# EAGLE design shield_scaffold (EAGLE 5.11)
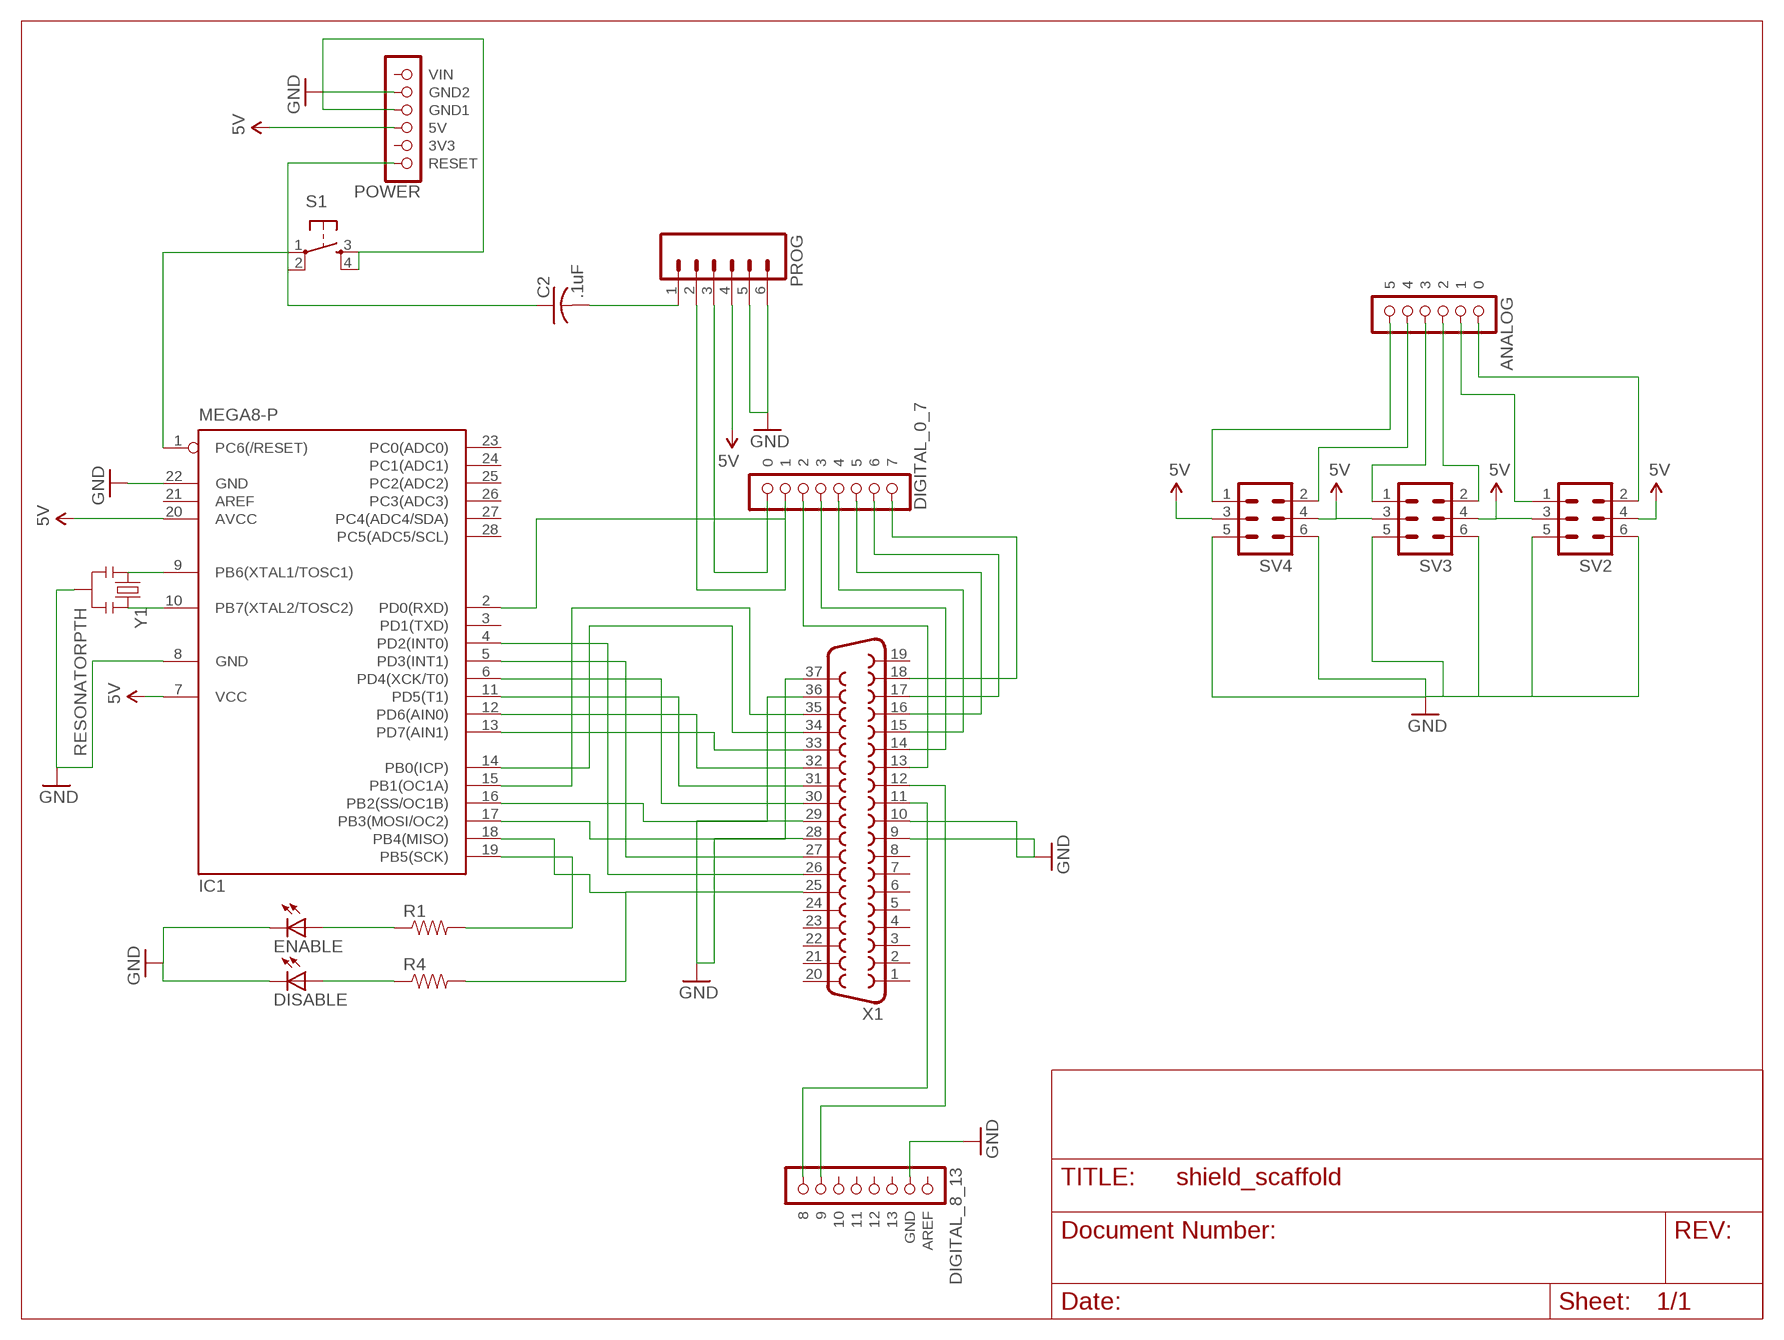
[diagram p0: schematic, sheet 1]

## Parts
C2  .1uF  C-US025-024X044  [C025-024X044]
DISABLE  LED5MM  [LED5MM]
ENABLE  LED5MM  [LED5MM]
IC1  MEGA8-P  [DIL28-3]
PROG  M06SIP_LOCK  [1X06-SIP_LOCK]
R1  RESISTORAXIAL-0.3  [AXIAL-0.3]
R4  RESISTORAXIAL-0.3  [AXIAL-0.3]
S1  TAC_SWITCHPTH  [TACTILE-PTH]
SV2  MA03-2  [MA03-2]
SV3  MA03-2  [MA03-2]
SV4  MA03-2  [MA03-2]
U$1  POWER  [1X06]
U$2  ANALOG  [1X06]
U$3  DIGITAL_0_7  [1X08]
U$4  DIGITAL_8_13  [1X08]
X1  F37VP  [F37VP]
Y1  RESONATORPTH  [RESONATOR-PTH]

## Nets
5V: IC1.7(VCC) IC1.20(AVCC) PROG.4 SV2.3 SV2.4 SV3.3 SV3.4 SV4.3 SV4.4 U$1.3(5V)
GND: DISABLE.K(C) ENABLE.K(C) IC1.8(GND) IC1.22(GND) PROG.5 PROG.6 S1.3 S1.4 SV2.5 SV2.6 SV3.5 SV3.6 SV4.5 SV4.6 U$1.4(GND1) U$1.5(GND2) U$4.2(GND) X1.9 X1.10 X1.28 X1.29 Y1.2
N$1: IC1.2(PD0(RXD)) PROG.2 U$3.7
N$2: IC1.9(PB6(XTAL1/TOSC1)) Y1.1
N$3: IC1.10(PB7(XTAL2/TOSC2)) Y1.3
N$4: SV2.2 U$2.1
N$5: SV2.1 U$2.2
N$6: SV3.2 U$2.3
N$7: SV3.1 U$2.4
N$8: SV4.2 U$2.5
N$9: SV4.1 U$2.6
N$10: U$4.7 X1.12
N$11: U$3.6 X1.13
N$12: U$3.5 X1.14
N$13: U$4.8 X1.11
N$14: U$3.4 X1.15
N$15: U$3.3 X1.16
N$16: U$3.2 X1.17
N$17: U$3.1 X1.18
N$18: IC1.19(PB5(SCK)) R1.P$2
N$19: IC1.4(PD2(INT0)) X1.26
N$20: IC1.5(PD3(INT1)) X1.27
N$21: IC1.6(PD4(XCK/T0)) X1.30
N$22: IC1.11(PD5(T1)) X1.31
N$23: IC1.18(PB4(MISO)) R4.P$2 X1.25
N$24: PROG.3 U$3.8
N$25: ENABLE.A R1.P$1
N$26: DISABLE.A R4.P$1
N$27: IC1.12(PD6(AIN0)) X1.32
N$28: IC1.13(PD7(AIN1)) X1.33
N$29: IC1.14(PB0(ICP)) X1.34
N$30: IC1.15(PB1(OC1A)) X1.35
N$31: IC1.16(PB2(SS/OC1B)) X1.36
N$32: IC1.17(PB3(MOSI/OC2)) X1.37
N$33: C2.2 PROG.1
N$34: C2.1 IC1.1(PC6(/RESET)) S1.1 S1.2 U$1.1(RESET)
Unconnected: IC1.3(PD1(TXD)) IC1.21(AREF) IC1.23(PC0(ADC0)) IC1.24(PC1(ADC1)) IC1.25(PC2(ADC2)) IC1.26(PC3(ADC3)) IC1.27(PC4(ADC4/SDA)) IC1.28(PC5(ADC5/SCL)) U$1.2(3V3) U$1.6(VIN) U$4.1(AREF) U$4.3 U$4.4 U$4.5 U$4.6 X1.1 X1.2 X1.3 X1.4 X1.5 X1.6 X1.7 X1.8 X1.19 X1.20 X1.21 X1.22 X1.23 X1.24

## Library data of the parts
C2 = rcl:C-US: CAPACITOR, American symbol
DISABLE ENABLE = SparkFun:LED: LEDs Standard schematic elements and footprints for 5mm, 3mm, 1206, and 0603 sized LEDs. 5mm - Spark Fun Electronics SKU : COM-00529 (and others)
IC1 = atmel:MEGA8-P: MICROCONTROLLER 8 Kbytes FLASH, 1 kbytes SRAM, 512 bytes EEPROM, USART, 4-channel 10 bit ADC, 2-channel 8 bit ADC Pin compatible with Atmega48, ATMega88, ATMega168 Source: avr.lbr; OC_FARNELL: unknown; OC_NEWARK: unknown
PROG = SparkFun:M06: Header 6 Standard 6-pin 0.1" header. Use with straight break away headers (SKU : PRT-00116), right angle break away headers (PRT-00553), swiss pins (PRT-00743), machine pins (PRT-00117), and female headers (PRT-00115). Molex polarized connector foot print use with SKU : PRT-08094 with associated crimp pins and housings. NOTES ON THE VARIANTS LOCK and LOCK_LONGPADS... This footprint was designed to help hold the alignment of a through-hole component (i.e. 6-pin header) while soldering it into place. You may notice that each hole has been shifted either up or down by 0.005 of an inch from it's more standard position (which is a perfectly straight line). This slight alteration caused the pins (the squares in the middle) to touch the edges of the holes. Because they are alternating, it causes a "brace" to hold the component in place. 0.005 has proven to be the perfect amount of "off-center" position when using our standard breakaway headers. Although looks a little odd when you look at the bare footprint, once you have a header in there, the alteration is very hard to notice. Also, if you push a header all the way into place, it is covered up entirely on the bottom side. This idea of altering the position of holes to aid alignment will be further integrated into the Sparkfun Library for other footprints. It can help hold any component with 3 or more connection pins.
R1 R4 = SparkFun:RESISTOR: Resistor Basic schematic elements and footprints for 0603, 1206, and PTH resistors.
S1 = SparkFun:TAC_SWITCH: Momentary Switch Button commonly used for reset or general input. Spark Fun Electronics SKU : COM-00097
SV2-SV4 = con-lstb:MA03-2: PIN HEADER; OC_FARNELL: unknown; OC_NEWARK: unknown
U$1 = arduino:POWER
U$2 = arduino:ANALOG
U$3 = arduino:DIGITAL_0_7
U$4 = arduino:DIGITAL_8_13
X1 = con-subd:F37: SUB-D; OC_FARNELL: unknown; OC_NEWARK: unknown
Y1 = SparkFun:RESONATOR: Resonator Small SMD resonator. This is the itty bitty 10/20MHz resonators with built in caps. CSTCE10M0G55 and CSTCE20M0V53. Footprint has been reviewed closely but hasn't been tested yet.

## Board
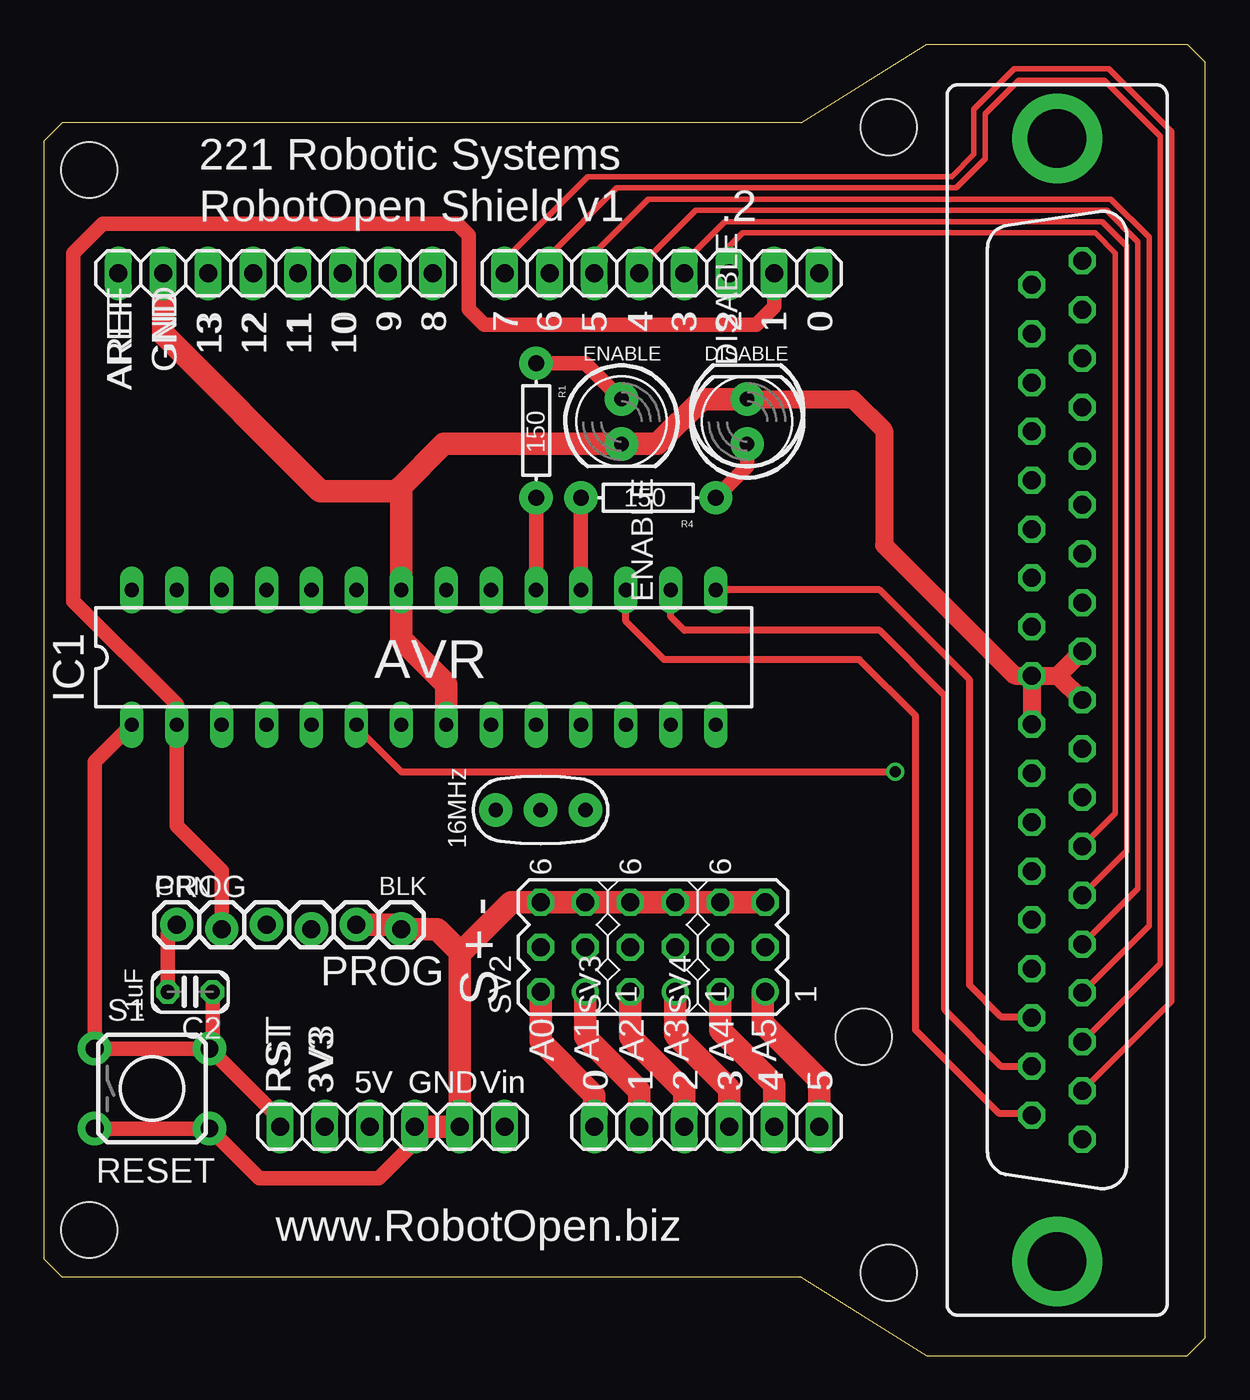
[diagram p1: board, top side]
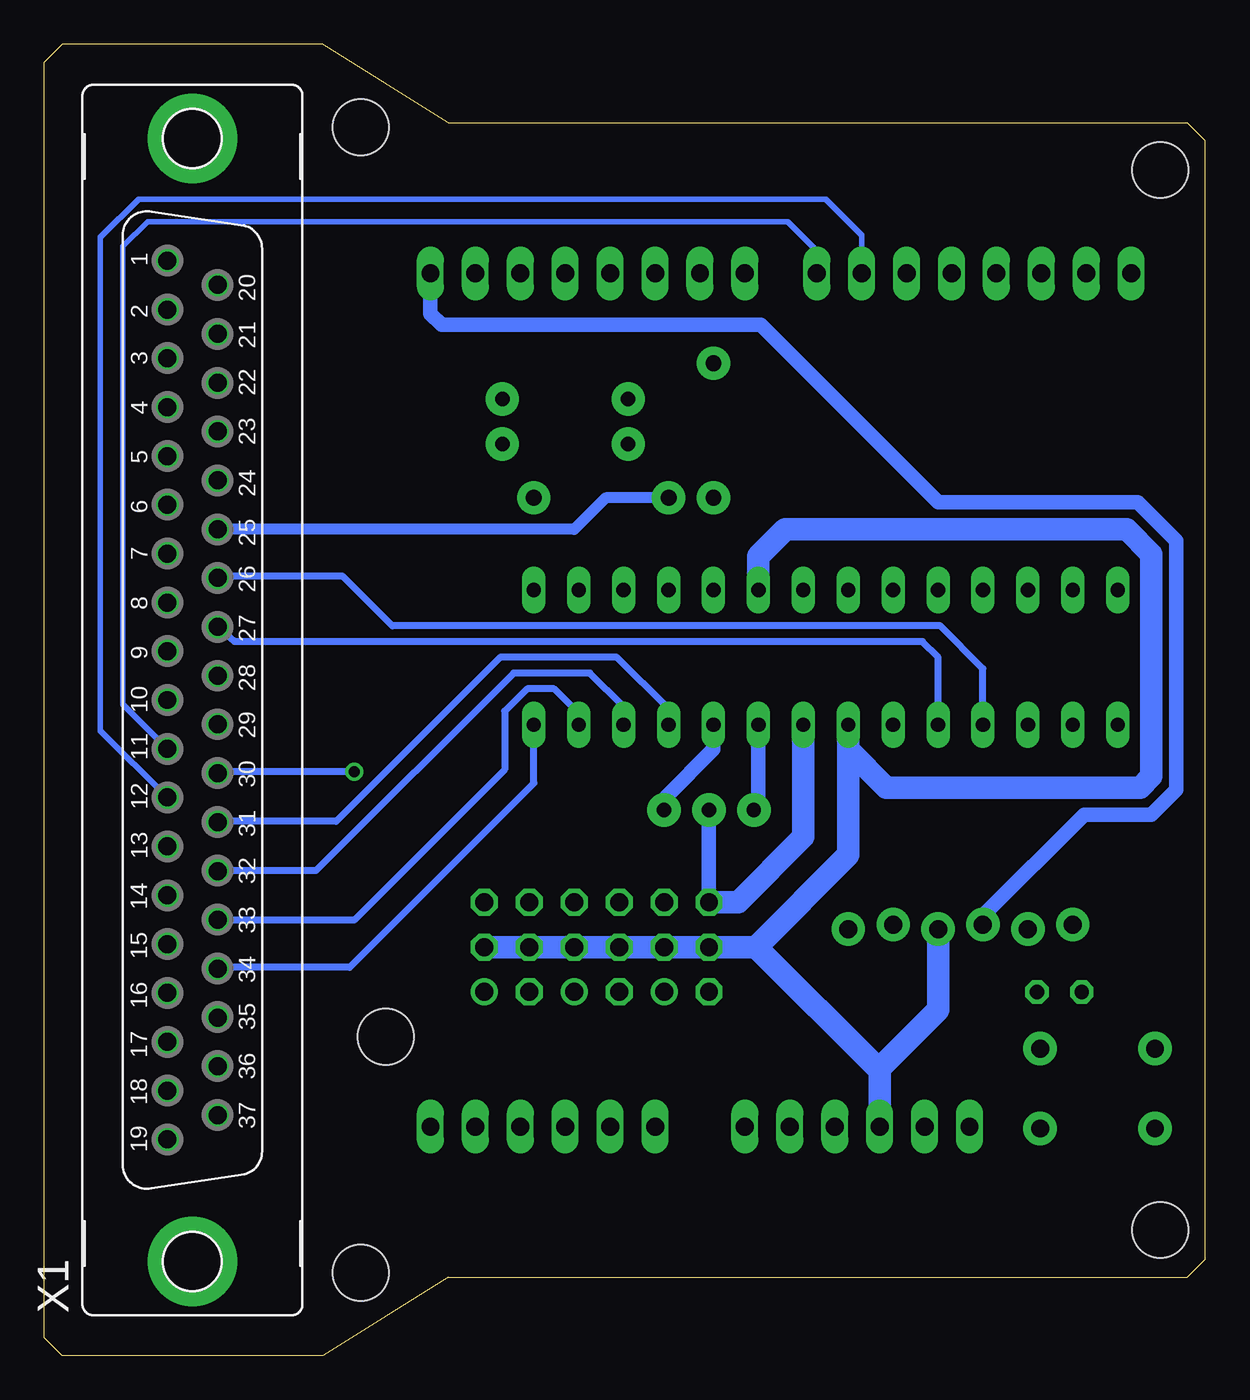
[diagram p2: board, bottom side, seen from below]

Size 65.66 x 74.17 mm. Coordinates in mm from the lower left corner, seen from the top.
Outline: 64.64,0 65.66,1.02 65.66,73.15 64.64,74.17 49.91,74.17 42.8,69.72 1.02,69.72 0,68.71 0,5.46 1.02,4.45 42.8,4.45 49.91,0 64.64,0
Copper layers (1*16): Top 0.035mm / dielectric 1.5mm / Bottom 0.035mm
Design rules "default": minimum track width 10mil, minimum drill 24mil, track to track 8mil, track to pad 8mil, pad to pad 8mil, via to via 8mil, smd to smd 8mil, copper to edge 40mil, drill to drill 8mil, minimum pad ring 10mil, minimum via ring 8mil, stop-mask expansion 4mil, vias tented up to drill 0mil, thermal gap 10mil
Holes 3.17 mm at 46.36,18.03 2.54,67.06 47.75,69.47 2.54,7.11 47.75,4.7

### Footprints (pad centres in the part's own frame; a part is rotated, then mirrored left to right if it is on the bottom)
C025-024X044 = drill 0.813 octagon: 1 -1.27,0; 2 1.27,0
LED5MM = drill 0.813 pad 1.88 round: A -1.27,0; K 1.27,0
DIL28-3 = drill 0.813 long: 1 -16.51,-3.81; 2 -13.97,-3.81; 3 -11.43,-3.81; 4 -8.89,-3.81; 5 -6.35,-3.81; 6 -3.81,-3.81; 7 -1.27,-3.81; 8 1.27,-3.81; 9 3.81,-3.81; 10 6.35,-3.81; 11 8.89,-3.81; 12 11.43,-3.81; 13 13.97,-3.81; 14 16.51,-3.81; 15 16.51,3.81; 16 13.97,3.81; 17 11.43,3.81; 18 8.89,3.81; 19 6.35,3.81; 20 3.81,3.81; 21 1.27,3.81; 22 -1.27,3.81; 23 -3.81,3.81; 24 -6.35,3.81; 25 -8.89,3.81; 26 -11.43,3.81; 27 -13.97,3.81; 28 -16.51,3.81
1X06-SIP_LOCK = drill 1.016 pad 1.88 round: 1 0,0; 2 2.54,-0.254; 3 5.08,0; 4 7.62,-0.254; 5 10.16,0; 6 12.7,-0.254
AXIAL-0.3 = drill 0.9 pad 1.88 round: P$1 -3.81,0; P$2 3.81,0
TACTILE-PTH = drill 1.016 pad 1.88 round: 1 -3.251,2.261; 2 3.251,2.261; 3 -3.251,-2.261; 4 3.251,-2.261
MA03-2 = drill 1.016 round: 1 -2.54,-1.27 | drill 1.016 octagon: 2 -2.54,1.27; 3 0,-1.27; 4 0,1.27; 5 2.54,-1.27; 6 2.54,1.27
1X06 = drill 1.016 long: 1 -6.35,0; 2 -3.81,0; 3 -1.27,0; 4 1.27,0; 5 3.81,0; 6 6.35,0
1X08 = drill 1.016 long: 1 -8.89,0; 2 -6.35,0; 3 -3.81,0; 4 -1.27,0; 5 1.27,0; 6 3.81,0; 7 6.35,0; 8 8.89,0
F37VP = drill 1.016 octagon: 1 24.841,1.422; 2 22.073,1.422; 3 19.329,1.422; 4 16.561,1.422; 5 13.792,1.422; 6 11.049,1.422; 7 8.28,1.422; 8 5.512,1.422; 9 2.769,1.422; 10 0,1.422; 11 -2.769,1.422; 12 -5.512,1.422; 13 -8.28,1.422; 14 -11.049,1.422; 15 -13.818,1.422; 16 -16.561,1.422; 17 -19.329,1.422; 18 -22.098,1.422; 19 -24.841,1.422; 20 23.47,-1.422; 21 20.701,-1.422; 22 17.932,-1.422; 23 15.189,-1.422; 24 12.421,-1.422; 25 9.652,-1.422; 26 6.909,-1.422; 27 4.14,-1.422; 28 1.372,-1.422; 29 -1.372,-1.422; 30 -4.14,-1.422; 31 -6.909,-1.422; 32 -9.677,-1.422; 33 -12.421,-1.422; 34 -15.189,-1.422; 35 -17.958,-1.422; 36 -20.701,-1.422; 37 -23.47,-1.422 | drill 3.302 pad 5.08 round: G1 -31.75,0; G2 31.75,0
RESONATOR-PTH = drill 0.8 pad 1.88 round: 1 -2.54,0; 2 0,0; 3 2.54,0

### Placement (x,y rotation side)
C2  8.26,20.57 180 top
DISABLE  39.75,52.83 90 top
ENABLE  32.64,52.83 270 top
IC1  21.46,39.5 0 top
PROG  7.49,24.38 0 top
R1  27.81,52.32 270 top
R4  34.16,48.51 180 top
S1  6.1,15.11 0 top
SV2  29.34,23.11 90 top
SV3  34.42,23.11 90 top
SV4  39.5,23.11 90 top
U$1  19.69,12.95 0 top
U$2  37.47,12.95 0 top
U$3  34.93,61.21 0 top
U$4  13.08,61.21 0 top
X1  57.28,37.08 90 bottom
Y1  28.07,30.86 0 top

### Tracks (layer width: path | path; a pad name or v marks a point on that pad's centre or on a via)
5V
  Bottom 1.27: U$1.3 18.41,16.13 18.48,16.19 | 18.48,16.19 25.4,23.11 | 25.4,23.11 SV2.4 SV2.3 SV3.4 SV3.3 SV4.4 SV4.3 | 20.19,34.29 20.19,28.32 25.4,23.11 | 20.19,34.29 IC1.7 | IC1.20 25.27,45.21 23.75,46.74 4.45,46.74 3.05,45.34 3.05,32.77 3.68,32.13 18.03,32.13 20.19,34.29 | PROG.4 15.11,19.56 18.48,16.19
GND
  Top 0.813: S1.3 S1.4 12.17,10.03 18.92,10.03 20.95,12.06 U$1.4
  Top 1.016: X1.28 54.89,38.46 47.5,45.85 47.5,52.32 45.72,54.1 DISABLE.K | X1.28 57.3,38.46 X1.9 | X1.28 57.33,38.46 X1.10 | X1.28 X1.29
  Top 1.27: U$1.4 U$1.5 23.5,22.73 23.56,22.8 | 23.56,22.8 26.42,25.65 SV2.6 SV2.5 SV3.6 SV3.5 SV4.6 SV4.5 | 20.19,49.15 22.61,51.56 ENABLE.K 34.67,51.56 37.21,54.1 DISABLE.K | 20.19,49.15 IC1.22 20.19,40.51 22.73,37.97 IC1.8 | U$4.2 6.73,57.78 15.62,48.9 19.94,48.9 20.19,49.15 | PROG.5 20.19,24.38 PROG.6 22.23,24.13 23.56,22.8
  Bottom 0.813: SV2.6 Y1.2
  Bottom 1.27: IC1.8 22.73,29.34 26.42,25.65 SV2.6
N$1
  Top 0.813: U$3.7 41.27,59.31 40.26,58.29 24.89,58.29 24,59.18 24,63.37 23.37,64.01 3.3,64.01 1.65,62.36 1.65,42.67 7.49,36.83 IC1.2 7.49,29.97 10.03,27.43 PROG.2
N$2
  Bottom 0.813: Y1.1 25.27,31.11 IC1.9
N$3
  Bottom 0.813: IC1.10 27.81,34.29 30.48,31.62 30.48,30.99 Y1.3
N$4
  Top 1.27: U$2.1 31.12,14.73 28.07,17.78 SV2.2
N$5
  Top 1.27: U$2.2 33.66,14.99 30.61,18.03 SV2.1
N$6
  Top 1.27: U$2.3 36.2,14.99 33.15,18.03 SV3.2
N$7
  Top 1.27: U$2.4 38.73,15.11 35.69,18.16 SV3.1
N$8
  Top 1.27: U$2.5 41.27,15.37 38.23,18.41 SV4.2
N$9
  Top 1.27: U$2.6 43.81,15.62 40.64,18.8 40.64,20.45 SV4.1
N$10
  Bottom 0.305: U$4.7 19.43,63.37 21.46,65.41 60.33,65.41 62.48,63.25 62.48,35.36 X1.12
N$11
  Top 0.305: U$3.6 38.73,62.74 39.5,63.5 59.44,63.5 60.58,62.36 60.58,30.68 X1.13
N$12
  Top 0.305: U$3.5 36.2,61.85 38.48,64.14 59.82,64.14 61.21,62.74 61.21,28.55 X1.14
N$13
  Bottom 0.305: U$4.8 21.97,62.48 23.62,64.14 59.82,64.14 61.21,62.74 61.21,36.83 X1.11
N$14
  Top 0.305: U$3.4 33.66,61.59 36.83,64.77 60.07,64.77 61.85,62.99 61.85,26.42 X1.15
N$15
  Top 0.305: U$3.3 31.12,62.36 34.16,65.41 60.33,65.41 62.48,63.25 62.48,24.31 X1.16
N$16
  Top 0.305: U$3.2 28.58,62.23 32.38,66.04 51.56,66.04 53.21,67.69 53.21,70.23 55.12,72.14 59.94,72.14 63.12,68.96 63.12,22.17 X1.17
N$17
  Top 0.305: U$3.1 26.04,61.98 30.73,66.67 51.31,66.67 52.58,67.94 52.58,70.48 54.86,72.77 60.2,72.77 63.75,69.22 63.75,20.04 X1.18
N$18
  Top 0.813: IC1.19 R1.P$2
N$19
  Bottom 0.406: IC1.4 12.57,38.86 14.99,41.27 45.97,41.27 48.77,44.07 55.78,44.07 X1.26
N$20
  Bottom 0.406: IC1.5 15.11,39.5 16,40.39 54.89,40.39 X1.27
N$21  (via drill 0.61)
  Top 0.406: IC1.6 17.65,35.56 20.19,33.02 v48.13,33.02
  Bottom 0.406: v48.13,33.02 55.78,33.02 X1.30
N$22
  Bottom 0.406: IC1.11 30.35,36.58 33.27,39.5 39.88,39.5 49.15,30.23 55.8,30.23 X1.31
N$23
  Top 0.813: IC1.18 R4.P$2
  Bottom 0.61: R4.P$2 33.91,48.51 35.69,46.74 X1.25
N$24
  Bottom 0.813: PROG.3 12.57,24.89 6.86,30.61 3.05,30.61 1.65,32 1.65,46.1 3.81,48.26 15.11,48.26 25.15,58.29 43.18,58.29 43.81,58.93 U$3.8
N$25
  Top 0.813: R1.P$1 30.61,56.13 ENABLE.A
N$26
  Top 0.813: DISABLE.A 39.75,50.29 R4.P$1
N$27
  Bottom 0.406: IC1.12 32.89,36.7 34.8,38.61 39.12,38.61 50.29,27.43 55.83,27.43 X1.32
N$28
  Bottom 0.406: IC1.13 35.43,36.32 36.83,37.72 38.35,37.72 39.62,36.45 39.62,33.15 48.13,24.64 55.83,24.64 X1.33
N$29
  Bottom 0.406: IC1.14 37.97,32.38 48.39,21.97 55.78,21.97 X1.34
N$30
  Top 0.406: IC1.15 47.24,43.31 52.32,38.23 52.32,20.95 54.1,19.18 55.8,19.18 X1.35
N$31
  Top 0.406: IC1.16 35.43,41.78 36.2,41.02 47.24,41.02 50.93,37.34 50.93,19.56 54.1,16.38 X1.36
N$32
  Top 0.406: IC1.17 32.89,41.53 35.05,39.37 46.1,39.37 49.28,36.2 49.28,18.41 53.97,13.72 55.75,13.72 X1.37
N$33
  Top 0.813: C2.2 6.99,23.88 PROG.1
N$34
  Top 0.813: IC1.1 2.85,33.58 S1.1 S1.2 | S1.2 13.34,13.39 U$1.1 | C2.1 9.53,17.55 S1.2

### Text on the board
tNames: 9 | 8 | 7 | 6 | 5 | 4 | 3 | 2 | 1 | 0 | 13 | 12 | 11 | 10 | GND | AREF | RST | 3V3 | 5V | GND | Vin | 0 | 1 | 2 | 3 | 4 | 5
ArduinoHoles: 3.2mm | 3.2mm | 3.2mm | 3.2mm | 3.2mm
_tsilk: 221 Robotic Systems | RobotOpen Shield v1 | .2 | 9 | 8 | 7 | 6 | 5 | 4 | 3 | 2 | 1 | 0 | 13 | 12 | 11 | 10 | GND | ENABLE | DISABLE | AREF | 150 | 150 | AVR | 16MHz | GRN | BLK | - | + | PROG | S | .1uF | A0 | A1 | A2 | A3 | A4 | A5 | RST | 3V3 | 5V | GND | Vin | 0 | 1 | 2 | 3 | 4 | 5 | RESET | www.RobotOpen.biz